# EAGLE schematic PCBtest_2b (EAGLE 9.6.2)
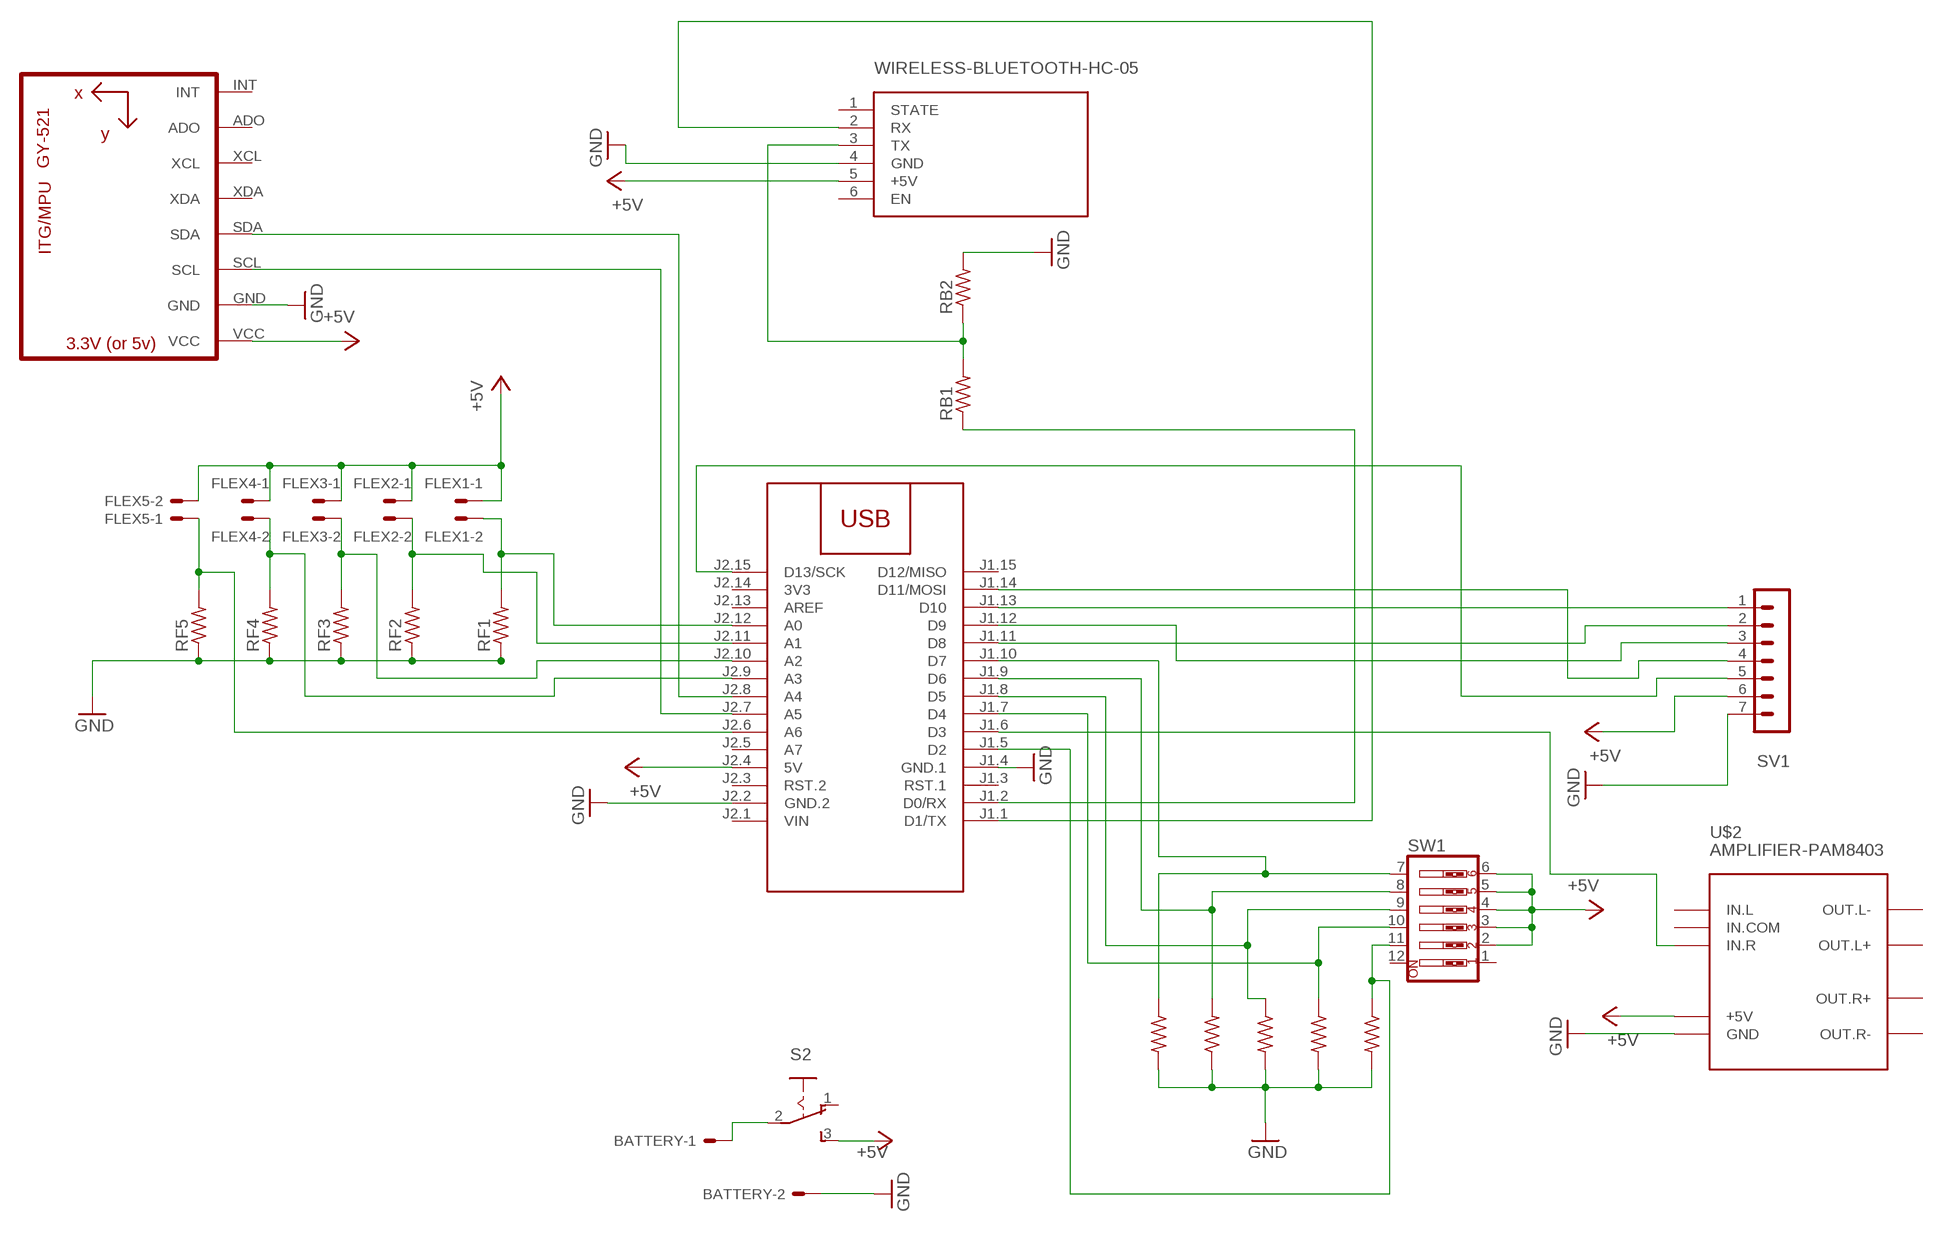
[diagram p0: schematic, sheet 1]

## Parts
BATTERY  332-02  [332-02]
FLEX1  332-02  [332-02]
FLEX2  332-02  [332-02]
FLEX3  332-02  [332-02]
FLEX4  332-02  [332-02]
FLEX5  332-02  [332-02]
M1  ARDUINO-NANO-3.0  [ARDUINO-NANO-3.0]
RB1  R-US_0204/7  [0204/7]
RB2  R-US_0204/7  [0204/7]
RF1  R-US_0204/7  [0204/7]
RF2  R-US_0204/7  [0204/7]
RF3  R-US_0204/7  [0204/7]
RF4  R-US_0204/7  [0204/7]
RF5  R-US_0204/7  [0204/7]
RS1  R-US_0204/7  [0204/7]
RS2  R-US_0204/7  [0204/7]
RS3  R-US_0204/7  [0204/7]
RS4  R-US_0204/7  [0204/7]
RS5  R-US_0204/7  [0204/7]
S2  255SB  [255SB]
SV1  MA07-1  [MA07-1]
SW1  SW_DIP-6  [EDG-06]
U1  GY-521MPU6050  [GY-521]
U$1  WIRELESS-BLUETOOTH-HC-05  [WIRELESS-BLUETOOTH-HC-05]
U$2  AMPLIFIER-PAM8403  [AMPLIFIER-PAM8403]

## Nets
+5V: FLEX1.1 FLEX2.1 FLEX3.1 FLEX4.1 FLEX5.2 M1.J2.4(5V) S2.3(S) SV1.6 SW1.2 SW1.3 SW1.4 SW1.5 SW1.6 U1.VCC U$1.5(+5V) U$2.+5V
GND: BATTERY.2 M1.J1.4(GND.1) M1.J2.2(GND.2) RB2.2 RF1.1 RF2.1 RF3.1 RF4.1 RF5.1 RS1.2 RS2.2 RS3.2 RS4.1 RS5.2 SV1.7 U1.GND U$1.4(GND) U$2.GND
N$1: M1.J1.5(D2) RS1.1 SW1.11
N$2: FLEX5.1 M1.J2.6(A6) RF5.2
N$3: M1.J1.8(D5) RS3.1 SW1.9
N$4: FLEX3.2 M1.J2.10(A2) RF3.2
N$5: M1.J2.8(A4) U1.SDA
N$6: M1.J2.7(A5) U1.SCL
N$7: RB1.2 RB2.1 U$1.3(TX)
N$8: FLEX1.2 M1.J2.12(A0) RF1.2
N$9: M1.J1.6(D3) U$2.IN.R
N$10: M1.J1.1(D1/TX) U$1.2(RX)
N$11: M1.J1.2(D0/RX) RB1.1
N$12: M1.J1.9(D6) RS4.2 SW1.8
N$13: FLEX4.2 M1.J2.9(A3) RF4.2
N$15: M1.J1.13(D10) SV1.1
N$16: FLEX2.2 M1.J2.11(A1) RF2.2
N$17: M1.J1.11(D8) SV1.2
N$18: M1.J1.12(D9) SV1.3
N$19: BATTERY.1 S2.2(P)
N$20: M1.J1.14(D11/MOSI) SV1.4
N$21: M1.J2.15(D13/SCK) SV1.5
N$23: M1.J1.10(D7) RS5.1 SW1.7
N$24: M1.J1.7(D4) RS2.1 SW1.10
Unconnected: M1.J1.3(RST.1) M1.J1.15(D12/MISO) M1.J2.3(RST.2) M1.J2.5(A7) M1.J2.13(AREF) S2.1(O) SW1.1 SW1.12 U1.ADO U1.INT U1.XCL U1.XDA U$1.1(STATE) U$1.6(EN) U$2.IN.COM U$2.IN.L U$2.OUT.L+ U$2.OUT.L- U$2.OUT.R+ U$2.OUT.R-

## Power pins joined to a net without a drawn wire
3V3: M1.J2.14(3V3)
VIN: M1.J2.1(VIN)

## Library data of the parts
BATTERY FLEX1-FLEX5 = con-garry:332-02: 2 Pin - 2mm Dual Row Source: www.mpe-connector.de / garry_shortform_2012.pdf
M1 = diy-modules:ARDUINO-NANO-3.0: Arduino Nano 3.0 and compatible devices More details available here: https://www.arduino.cc/en/Main/ArduinoBoardNano Click here to find device on ebay.com <http://www.ebay.com/sch/arduino+nano>
RB1 RB2 RF1-RF5 RS1-RS5 = rcl:R-US_: RESISTOR, American symbol; SPICEPREFIX: R
S2 = switch:255SB: SLIDING SWITCH Distributor Buerklin, 11G810
SV1 = con-lstb:MA07-1: PIN HEADER; OC_FARNELL: unknown; OC_NEWARK: unknown
SW1 = special:SW_DIP-6: DIP SWITCH
U1 = gy-521:GY-521
U$1 = diy-modules:WIRELESS-BLUETOOTH-HC-05: Bluetooth Transceiver Module based on HC-05 board Tutorial is available here: https://arduino-info.wikispaces.com/BlueTooth-HC05-HC06-Modules-How-To Click here to find device on ebay.com <http://www.ebay.com/sch/hc-05+module+rs232>
U$2 = diy-modules:AMPLIFIER-PAM8403: Stereo Class-D 3W Audio Amplifier based on PAM8403 chip More details available here: http://artofcircuits.com/product/pam8403-5v-two-channel-stereo-mini-class-d-3w3w-audio-amplifier Click here to find device on ebay.com <http://www.ebay.com/sch/pam8403+mini+class+d>